# EAGLE schematic Attenuverting_LinExp_VCA_Bottom (EAGLE 8.3.2)

## Sheet 1 of 4: VCA Paths
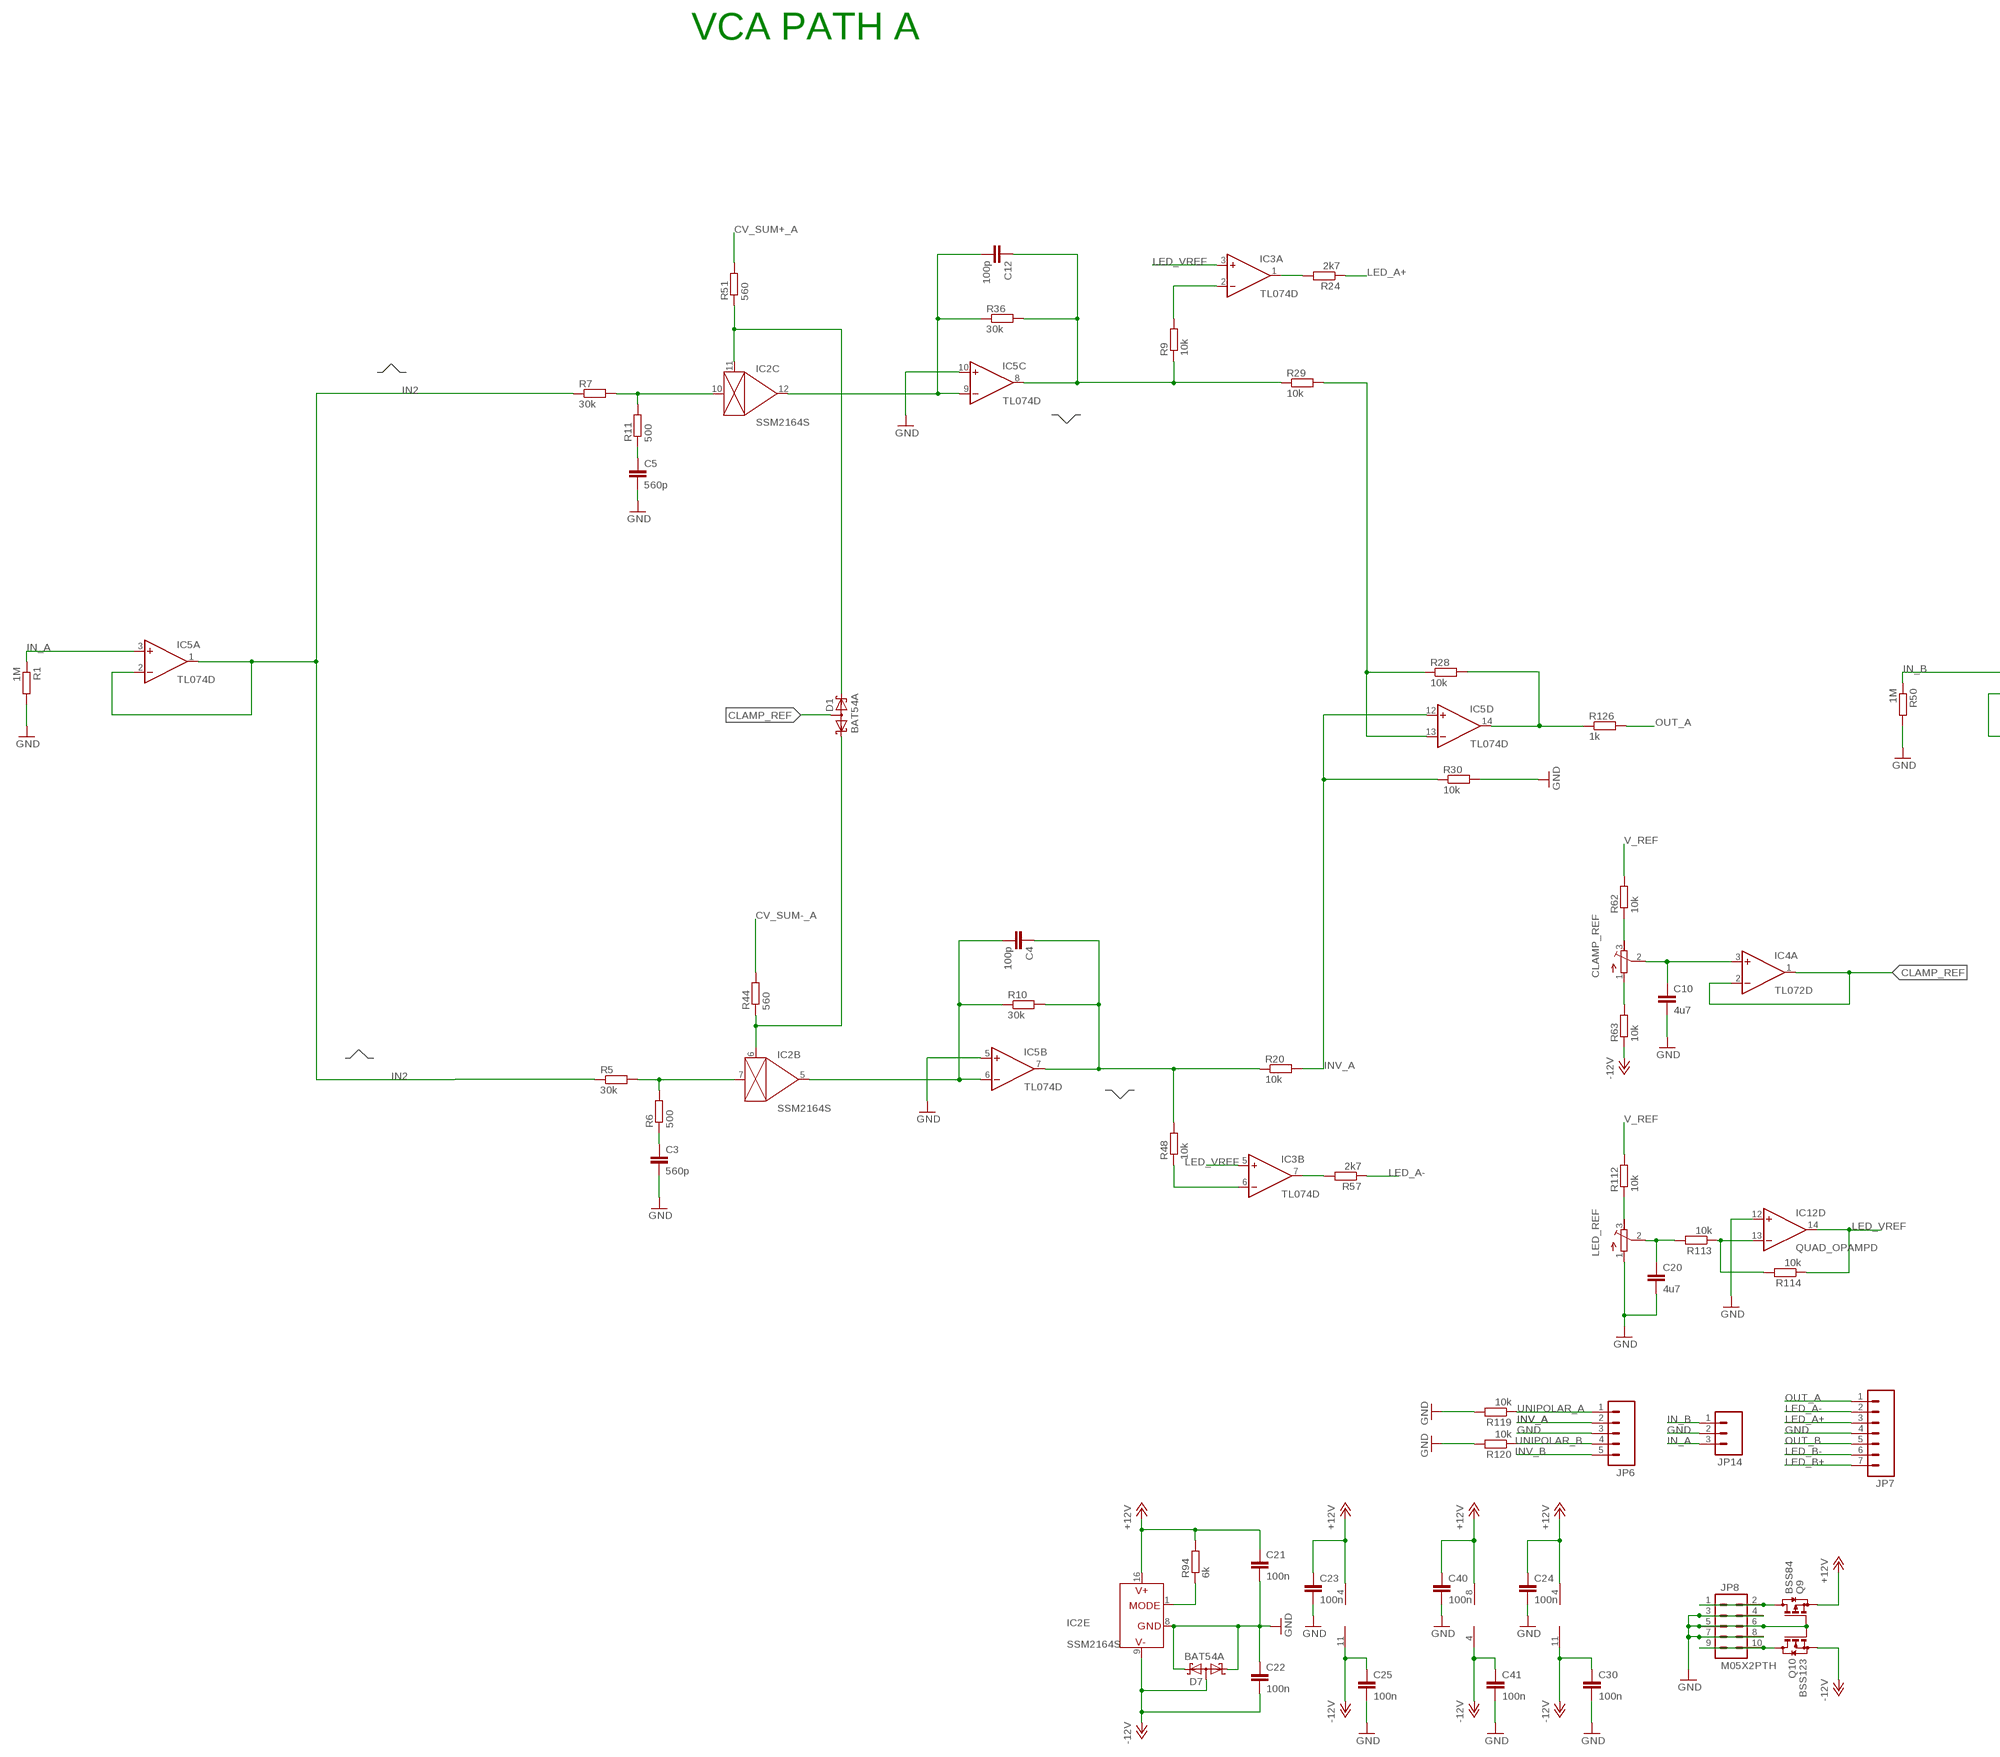
[diagram p0: schematic, sheet 1, part 1 of 2]
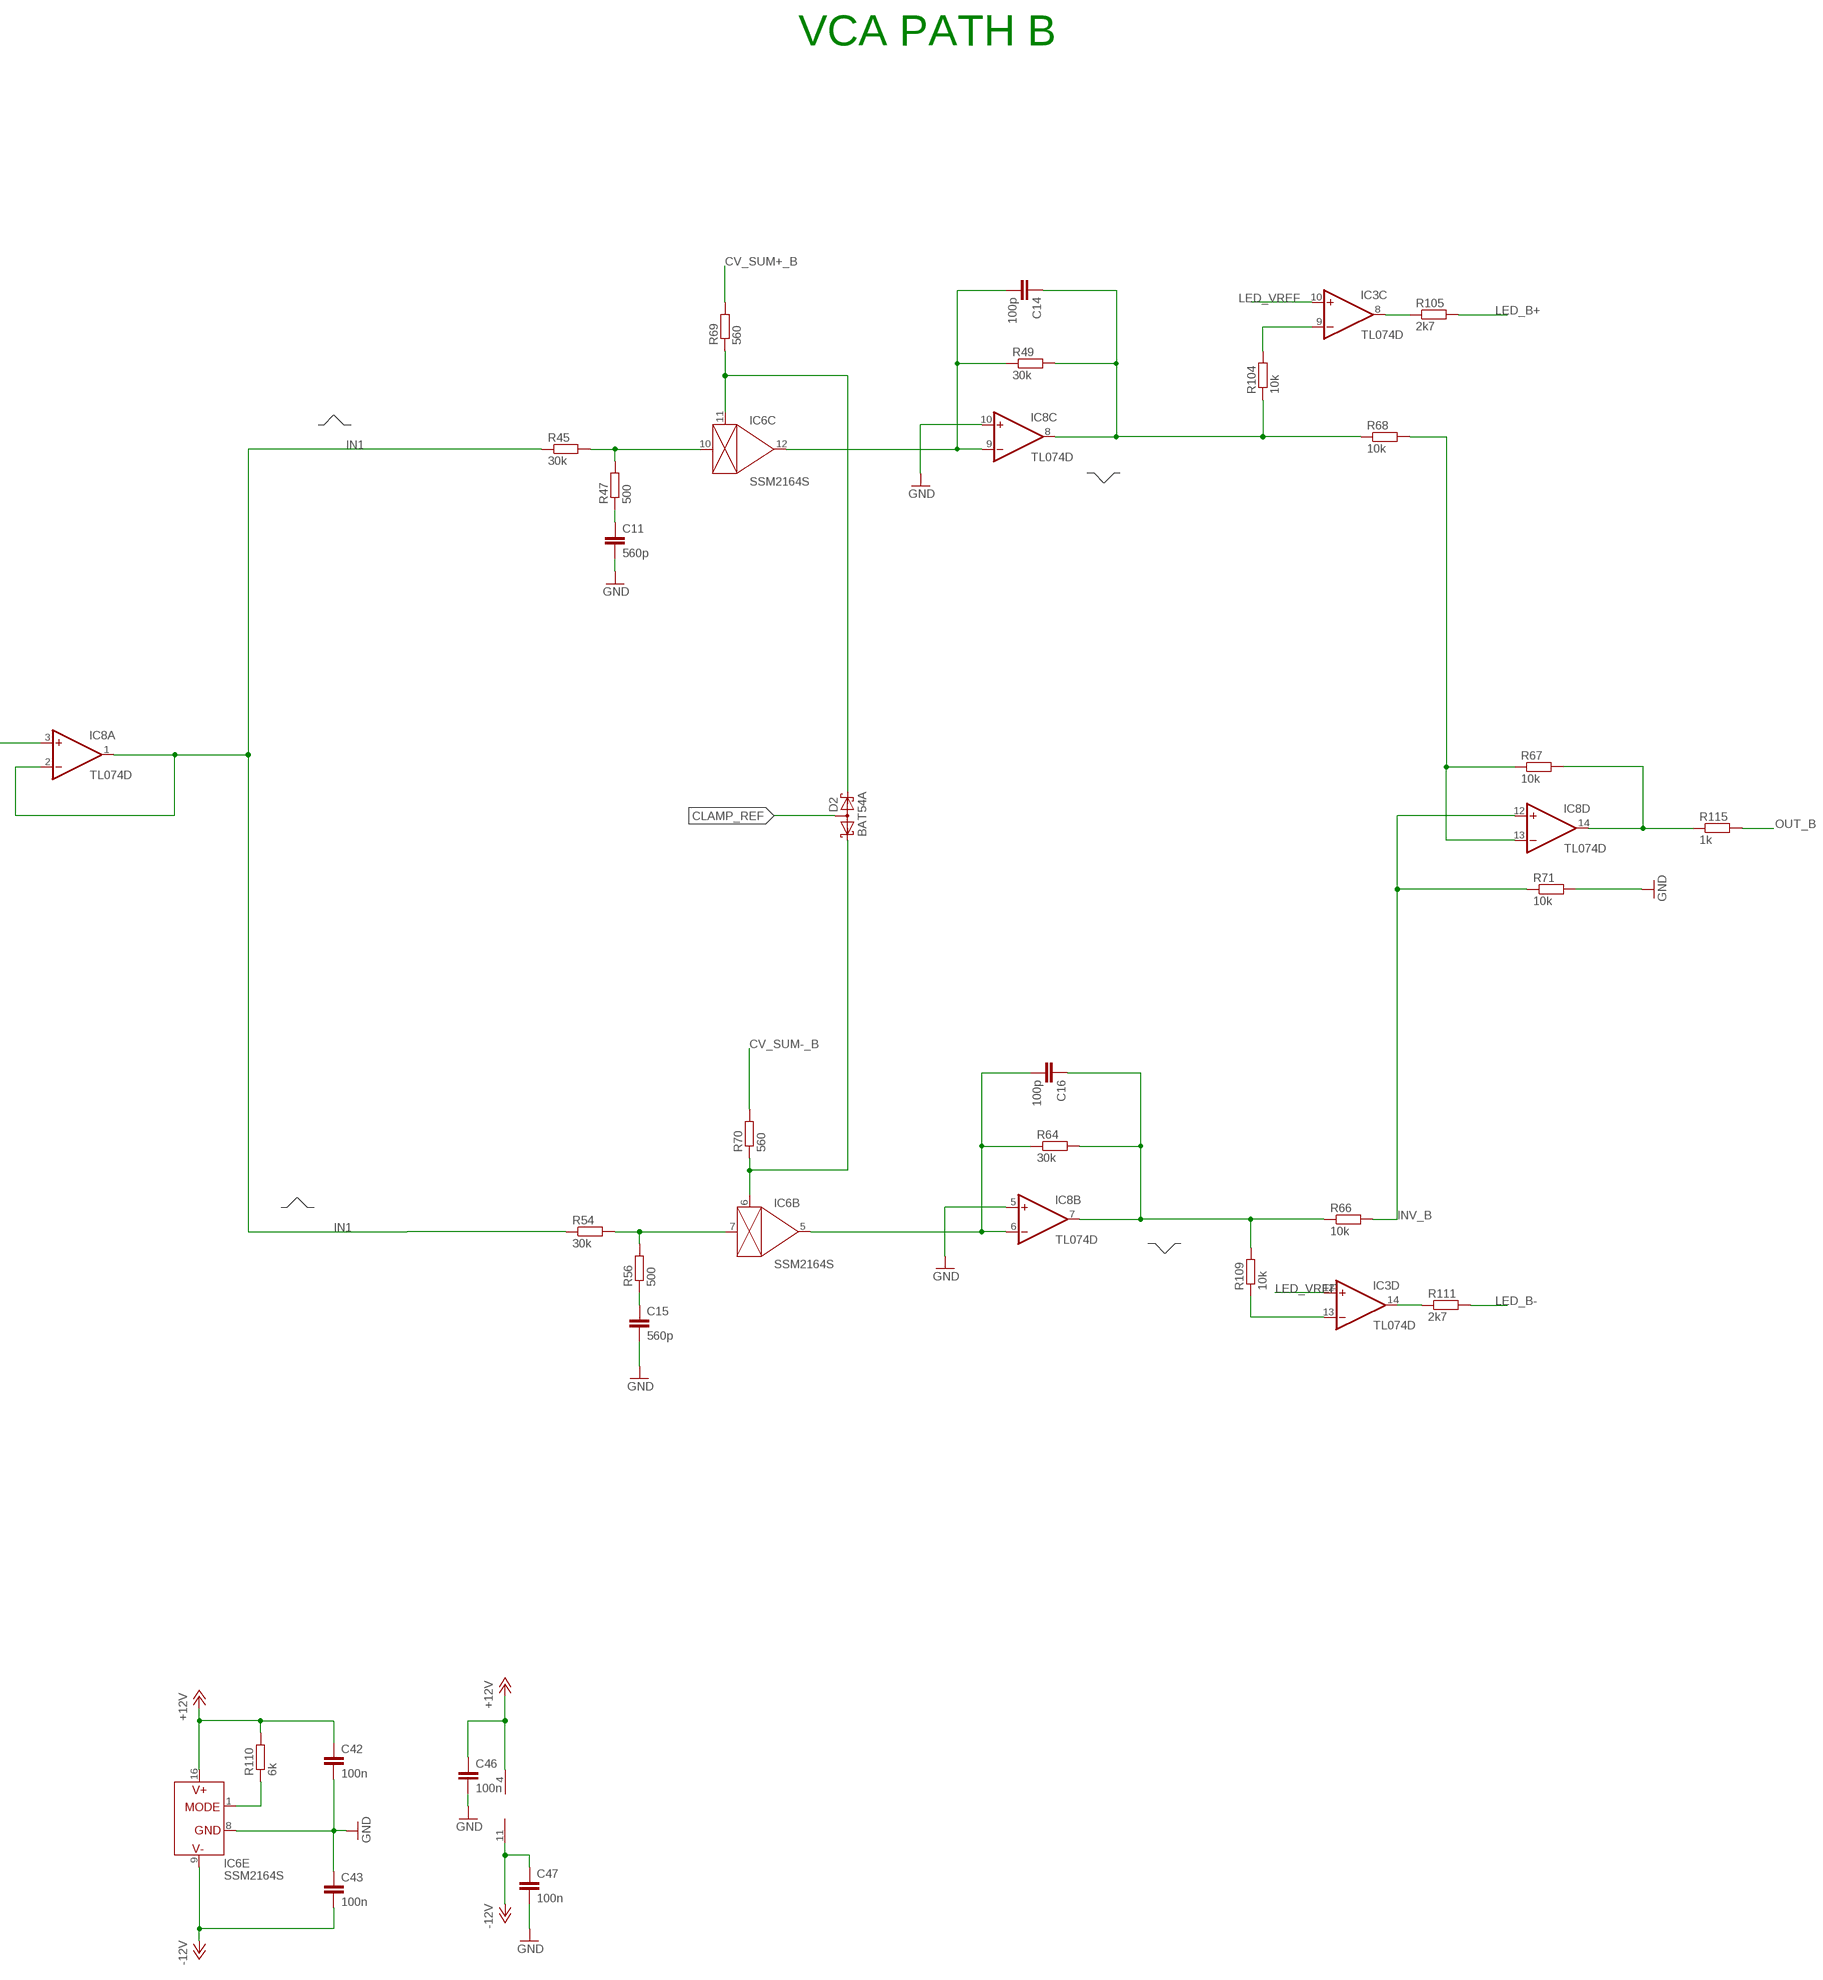
[diagram p1: schematic, sheet 1, part 2 of 2]

### Parts
C3  560p  C-EUC0603K  [C0603K]
C4  100p  C-EUC0603K  [C0603K]
C5  560p  C-EUC0603K  [C0603K]
C10  4u7  C-EUC0603K  [C0603K]
C11  560p  C-EUC0603K  [C0603K]
C12  100p  C-EUC0603K  [C0603K]
C14  100p  C-EUC0603K  [C0603K]
C15  560p  C-EUC0603K  [C0603K]
C16  100p  C-EUC0603K  [C0603K]
C20  4u7  C-EUC0603K  [C0603K]
C21  100n  C-EUC0603K  [C0603K]
C22  100n  C-EUC0603K  [C0603K]
C23  100n  C-EUC0603K  [C0603K]
C24  100n  C-EUC0603K  [C0603K]
C25  100n  C-EUC0603K  [C0603K]
C30  100n  C-EUC0603K  [C0603K]
C40  100n  C-EUC0603K  [C0603K]
C41  100n  C-EUC0603K  [C0603K]
C42  100n  C-EUC0603K  [C0603K]
C43  100n  C-EUC0603K  [C0603K]
C46  100n  C-EUC0603K  [C0603K]
C47  100n  C-EUC0603K  [C0603K]
CLAMP_REF  R-TRIMM64W  [RTRIM64W]
D1  BAT54A  [SOT23]
D2  BAT54A  [SOT23]
D7  BAT54A  [SOT23]
IC2  SSM2164S  [SOIC16N]
IC3  TL074D  [SO14]
IC4  TL072D  [SO08]
IC5  TL074D  [SO14]
IC6  SSM2164S  [SOIC16N]
IC8  TL074D  [SO14]
IC12  QUAD_OPAMPD  [SO14]
JP6  M05PTH  [1X05]
JP7  M07  [1X07]
JP8  M05X2PTH  [AVR_ICSP]
JP14  M03PTH  [1X03]
LED_REF  R-TRIMM64W  [RTRIM64W]
Q9  BSS84  [SOT23]
Q10  BSS123  [SOT23]
R1  1M  R-EU_0603  [0603]
R5  30k  R-EU_0603  [0603]
R6  500  R-EU_0603  [0603]
R7  30k  R-EU_0603  [0603]
R9  10k  R-EU_0603  [0603]
R10  30k  R-EU_0603  [0603]
R11  500  R-EU_0603  [0603]
R20  10k  R-EU_0603  [0603]
R24  2k7  R-EU_0603  [0603]
R28  10k  R-EU_0603  [0603]
R29  10k  R-EU_0603  [0603]
R30  10k  R-EU_0603  [0603]
R36  30k  R-EU_0603  [0603]
R44  560  R-EU_0603  [0603]
R45  30k  R-EU_0603  [0603]
R47  500  R-EU_0603  [0603]
R48  10k  R-EU_0603  [0603]
R49  30k  R-EU_0603  [0603]
R50  1M  R-EU_0603  [0603]
R51  560  R-EU_0603  [0603]
R54  30k  R-EU_0603  [0603]
R56  500  R-EU_0603  [0603]
R57  2k7  R-EU_0603  [0603]
R62  10k  R-EU_0603  [0603]
R63  10k  R-EU_0603  [0603]
R64  30k  R-EU_0603  [0603]
R66  10k  R-EU_0603  [0603]
R67  10k  R-EU_0603  [0603]
R68  10k  R-EU_0603  [0603]
R69  560  R-EU_0603  [0603]
R70  560  R-EU_0603  [0603]
R71  10k  R-EU_0603  [0603]
R94  6k  R-EU_0603  [0603]
R104  10k  R-EU_0603  [0603]
R105  2k7  R-EU_0603  [0603]
R109  10k  R-EU_0603  [0603]
R110  6k  R-EU_0603  [0603]
R111  2k7  R-EU_0603  [0603]
R112  10k  R-EU_0603  [0603]
R113  10k  R-EU_0603  [0603]
R114  10k  R-EU_0603  [0603]
R115  1k  R-EU_0603  [0603]
R119  10k  R-EU_0603  [0603]
R120  10k  R-EU_0603  [0603]
R126  1k  R-EU_0603  [0603]

### Nets
+12V: C21.1 C23.1 C24.1 C40.1 C42.1 C46.1 IC2.16(E:V+) IC3.4(P:V+) IC4.8(P:V+) IC5.4(P:V+) IC6.16(E:V+) IC8.4(P:V+) Q9.2(S) R94.2 R110.2 ; also sheet 2,3,4
-12V: C22.2 C25.1 C30.1 C41.1 C43.2 C47.1 D7.3(AA) IC2.9(E:V-) IC3.11(P:V-) IC4.4(P:V-) IC5.11(P:V-) IC6.9(E:V-) IC8.11(P:V-) Q10.2(S) R63.1 ; also sheet 2,3,4
CLAMP_REF: D1.3(AA) D2.3(AA) IC4.1(A:OUT) IC4.2(A:-IN)
CV_SUM+_A: R51.2 ; also sheet 4
CV_SUM+_B: R69.2 ; also sheet 4
CV_SUM-_A: R44.2 ; also sheet 4
CV_SUM-_B: R70.2 ; also sheet 4
GND: C3.2 C5.2 C10.2 C11.2 C15.2 C20.2 C21.2 C22.1 C23.2 C24.2 C25.2 C30.2 C40.2 C41.2 C42.2 C43.1 C46.2 C47.2 D7.1(K1) D7.2(K2) IC2.8(E:GND) IC5.5(B:+IN) IC5.10(C:+IN) IC6.8(E:GND) IC8.5(B:+IN) IC8.10(C:+IN) IC12.12(D:+IN) JP6.3 JP7.4 JP8.3 JP8.4 JP8.5 JP8.6 JP8.7 JP8.8 JP14.2 LED_REF.1(A) Q9.1(G) Q10.1(G) R1.2 R30.2 R50.2 R71.2 R119.2 R120.2 ; also sheet 2,3,4
IC2B_1: D2.1(K1) IC6.6(B:CTRL) R70.1
IC2B_6: D1.1(K1) IC2.6(B:CTRL) R44.1
IC2C_1: D2.2(K2) IC6.11(C:CTRL) R69.1
IC2C_11: D1.2(K2) IC2.11(C:CTRL) R51.1
IN1: IC8.1(A:OUT) IC8.2(A:-IN) R45.1 R54.1
IN2: IC5.1(A:OUT) IC5.2(A:-IN) R5.1 R7.1
IN_A: IC5.3(A:+IN) JP14.3 R1.1
IN_B: IC8.3(A:+IN) JP14.1 R50.1
INV_A: IC5.12(D:+IN) JP6.2 R20.2 R30.1
INV_B: IC8.12(D:+IN) JP6.5 R66.2 R71.1
LED_A+: JP7.3 R24.1
LED_A-: JP7.2 R57.1
LED_B+: JP7.7 R105.2
LED_B-: JP7.6 R111.2
LED_VREF: IC3.3(A:+IN) IC3.5(B:+IN) IC3.10(C:+IN) IC3.12(D:+IN) IC12.14(D:OUT) R114.1
N$4: JP8.9 JP8.10 Q10.3(D)
N$5: IC3.1(A:OUT) R24.2
N$6: C3.1 R6.1
N$7: JP8.1 JP8.2 Q9.3(D)
N$9: IC3.2(A:-IN) R9.2
N$13: IC12.13(D:-IN) R113.1 R114.2
N$14: IC3.6(B:-IN) R48.1
N$15: IC5.13(D:-IN) R28.1 R29.2
N$16: IC2.7(B:IN) R5.2 R6.2
N$18: IC3.7(B:OUT) R57.2
N$19: C5.1 R11.1
N$20: C4.2 IC2.5(B:OUT) IC5.6(B:-IN) R10.1
N$21: C4.1 IC5.7(B:OUT) R10.2 R20.1 R48.2
N$23: IC2.10(C:IN) R7.2 R11.2
N$24: IC5.14(D:OUT) R28.2 R126.1
N$25: C11.1 R47.1
N$26: IC3.9(C:-IN) R104.2
N$27: IC3.13(D:-IN) R109.1
N$33: IC6.10(C:IN) R45.2 R47.2
N$37: CLAMP_REF.3(E) R62.1
N$42: IC3.8(C:OUT) R105.1
N$43: IC3.14(D:OUT) R111.1
N$44: C14.2 IC6.12(C:OUT) IC8.9(C:-IN) R49.1
N$46: C14.1 IC8.8(C:OUT) R49.2 R68.1 R104.1
N$47: C15.1 R56.1
N$48: IC6.7(B:IN) R54.2 R56.2
N$49: C12.2 IC2.12(C:OUT) IC5.9(C:-IN) R36.1
N$50: LED_REF.3(E) R112.1
N$51: C12.1 IC5.8(C:OUT) R9.1 R29.1 R36.2
N$52: C16.2 IC6.5(B:OUT) IC8.6(B:-IN) R64.1
N$56: CLAMP_REF.1(A) R63.2
N$57: C10.1 CLAMP_REF.2(S) IC4.3(A:+IN)
N$59: C16.1 IC8.7(B:OUT) R64.2 R66.1 R109.2
N$60: IC8.13(D:-IN) R67.1 R68.2
N$61: IC8.14(D:OUT) R67.2 R115.1
N$63: C20.1 LED_REF.2(S) R113.2
N$83: IC2.1(E:MODE) R94.1
N$97: IC6.1(E:MODE) R110.1
OUT_A: JP7.1 R126.2
OUT_B: JP7.5 R115.2
UNIPOLAR_A: JP6.1 R119.1
UNIPOLAR_B: JP6.4 R120.1
V_REF: R62.2 R112.2 ; also sheet 3,4

### Notes on the sheet
- VCA PATH A
- VCA PATH B

## Sheet 2 of 4: Control Inputs
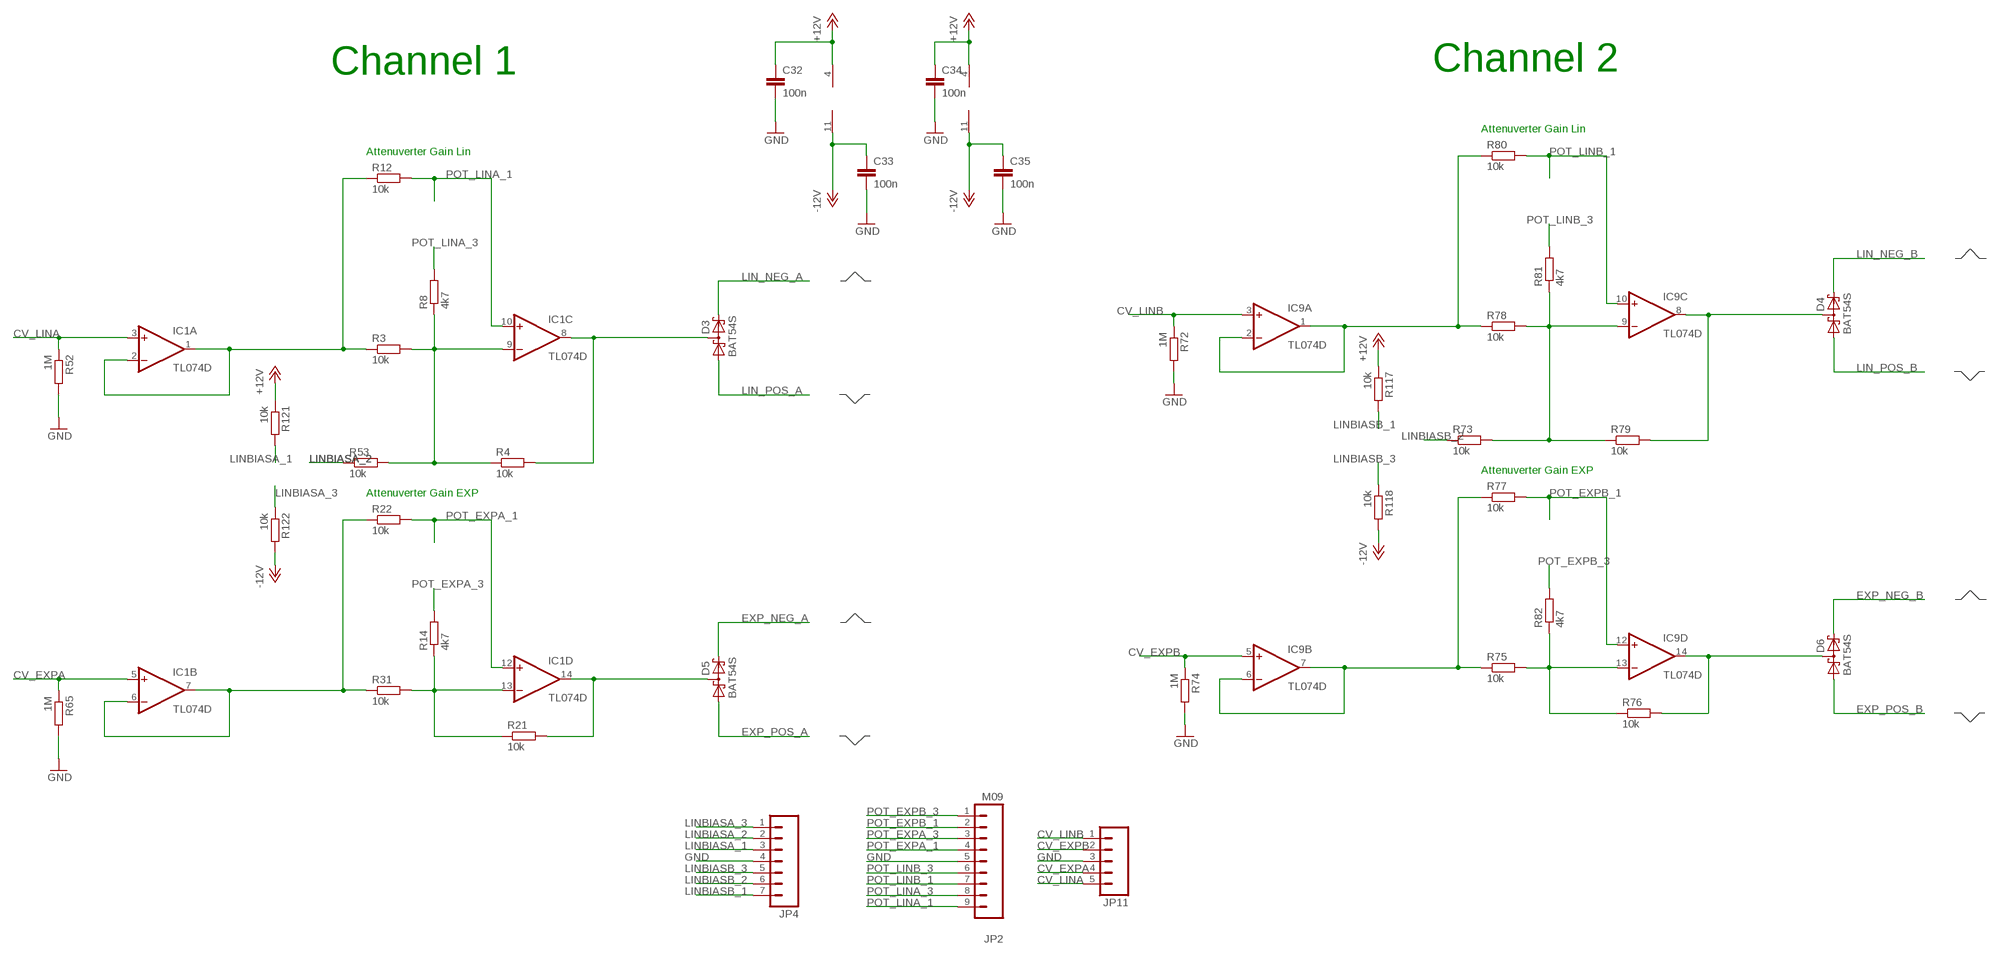
[diagram p2: schematic, sheet 2]

### Parts
C32  100n  C-EUC0603K  [C0603K]
C33  100n  C-EUC0603K  [C0603K]
C34  100n  C-EUC0603K  [C0603K]
C35  100n  C-EUC0603K  [C0603K]
D3  BAT54S  [SOT23]
D4  BAT54S  [SOT23]
D5  BAT54S  [SOT23]
D6  BAT54S  [SOT23]
IC1  TL074D  [SO14]
IC9  TL074D  [SO14]
JP2  M09  [1X09]
JP4  M07  [1X07]
JP11  M05PTH  [1X05]
R3  10k  R-EU_0603  [0603]
R4  10k  R-EU_0603  [0603]
R8  4k7  R-EU_0603  [0603]
R12  10k  R-EU_0603  [0603]
R14  4k7  R-EU_0603  [0603]
R21  10k  R-EU_0603  [0603]
R22  10k  R-EU_0603  [0603]
R31  10k  R-EU_0603  [0603]
R52  1M  R-EU_0603  [0603]
R53  10k  R-EU_0603  [0603]
R65  1M  R-EU_0603  [0603]
R72  1M  R-EU_0603  [0603]
R73  10k  R-EU_0603  [0603]
R74  1M  R-EU_0603  [0603]
R75  10k  R-EU_0603  [0603]
R76  10k  R-EU_0603  [0603]
R77  10k  R-EU_0603  [0603]
R78  10k  R-EU_0603  [0603]
R79  10k  R-EU_0603  [0603]
R80  10k  R-EU_0603  [0603]
R81  4k7  R-EU_0603  [0603]
R82  4k7  R-EU_0603  [0603]
R117  10k  R-EU_0603  [0603]
R118  10k  R-EU_0603  [0603]
R121  10k  R-EU_0603  [0603]
R122  10k  R-EU_0603  [0603]

### Nets
+12V: C32.1 C34.1 IC1.4(P:V+) IC9.4(P:V+) R117.1 R121.1 ; also sheet 1,3,4
-12V: C33.1 C35.1 IC1.11(P:V-) IC9.11(P:V-) R118.2 R122.2 ; also sheet 1,3,4
CV_1+: IC1.6(B:-IN) IC1.7(B:OUT) R22.1 R31.1
CV_1+1: IC9.6(B:-IN) IC9.7(B:OUT) R75.1 R77.1
CV_1-: IC1.1(A:OUT) IC1.2(A:-IN) R3.1 R12.1
CV_1-1: IC9.1(A:OUT) IC9.2(A:-IN) R78.1 R80.1
CV_EXPA: IC1.5(B:+IN) JP11.4 R65.1
CV_EXPB: IC9.5(B:+IN) JP11.2 R74.1
CV_LINA: IC1.3(A:+IN) JP11.5 R52.1
CV_LINB: IC9.3(A:+IN) JP11.1 R72.1
EXP_NEG_A: D5.2(C2) ; also sheet 4
EXP_NEG_B: D6.2(C2) ; also sheet 4
EXP_POS_A: D5.1(A1) ; also sheet 4
EXP_POS_B: D6.1(A1) ; also sheet 4
GND: C32.2 C33.2 C34.2 C35.2 JP2.5 JP4.4 JP11.3 R52.2 R65.2 R72.2 R74.2 ; also sheet 1,3,4
LIN_NEG_A: D3.2(C2) ; also sheet 3
LIN_NEG_B: D4.2(C2) ; also sheet 3
LIN_POS_A: D3.1(A1) ; also sheet 3
LIN_POS_B: D4.1(A1) ; also sheet 3
LINBIASA_1: JP4.3 R121.2
LINBIASA_2: JP4.2 R53.1
LINBIASA_3: JP4.1 R122.1
LINBIASB_1: JP4.7 R117.2
LINBIASB_2: JP4.6 R73.1
LINBIASB_3: JP4.5 R118.1
N$2: D3.3(C1A2) IC1.8(C:OUT) R4.2
N$12: IC1.13(D:-IN) R14.1 R21.1 R31.2
N$17: IC1.9(C:-IN) R3.2 R4.1 R8.1 R53.2
N$65: D6.3(C1A2) IC9.14(D:OUT) R76.2
N$66: IC9.13(D:-IN) R75.2 R76.1 R82.1
N$69: D4.3(C1A2) IC9.8(C:OUT) R79.2
N$74: IC9.9(C:-IN) R73.2 R78.2 R79.1 R81.1
N$94: D5.3(C1A2) IC1.14(D:OUT) R21.2
POT_EXPA_1: IC1.12(D:+IN) JP2.4 R22.2
POT_EXPA_3: JP2.3 R14.2
POT_EXPB_1: IC9.12(D:+IN) JP2.2 R77.2
POT_EXPB_3: JP2.1 R82.2
POT_LINA_1: IC1.10(C:+IN) JP2.9 R12.2
POT_LINA_3: JP2.8 R8.2
POT_LINB_1: IC9.10(C:+IN) JP2.7 R80.2
POT_LINB_3: JP2.6 R81.2

### Notes on the sheet
- Channel 2
- Channel 1
- Attenuverter Gain Lin
- Attenuverter Gain Lin
- Attenuverter Gain EXP
- Attenuverter Gain EXP

## Sheet 3 of 4: Linearsing CV
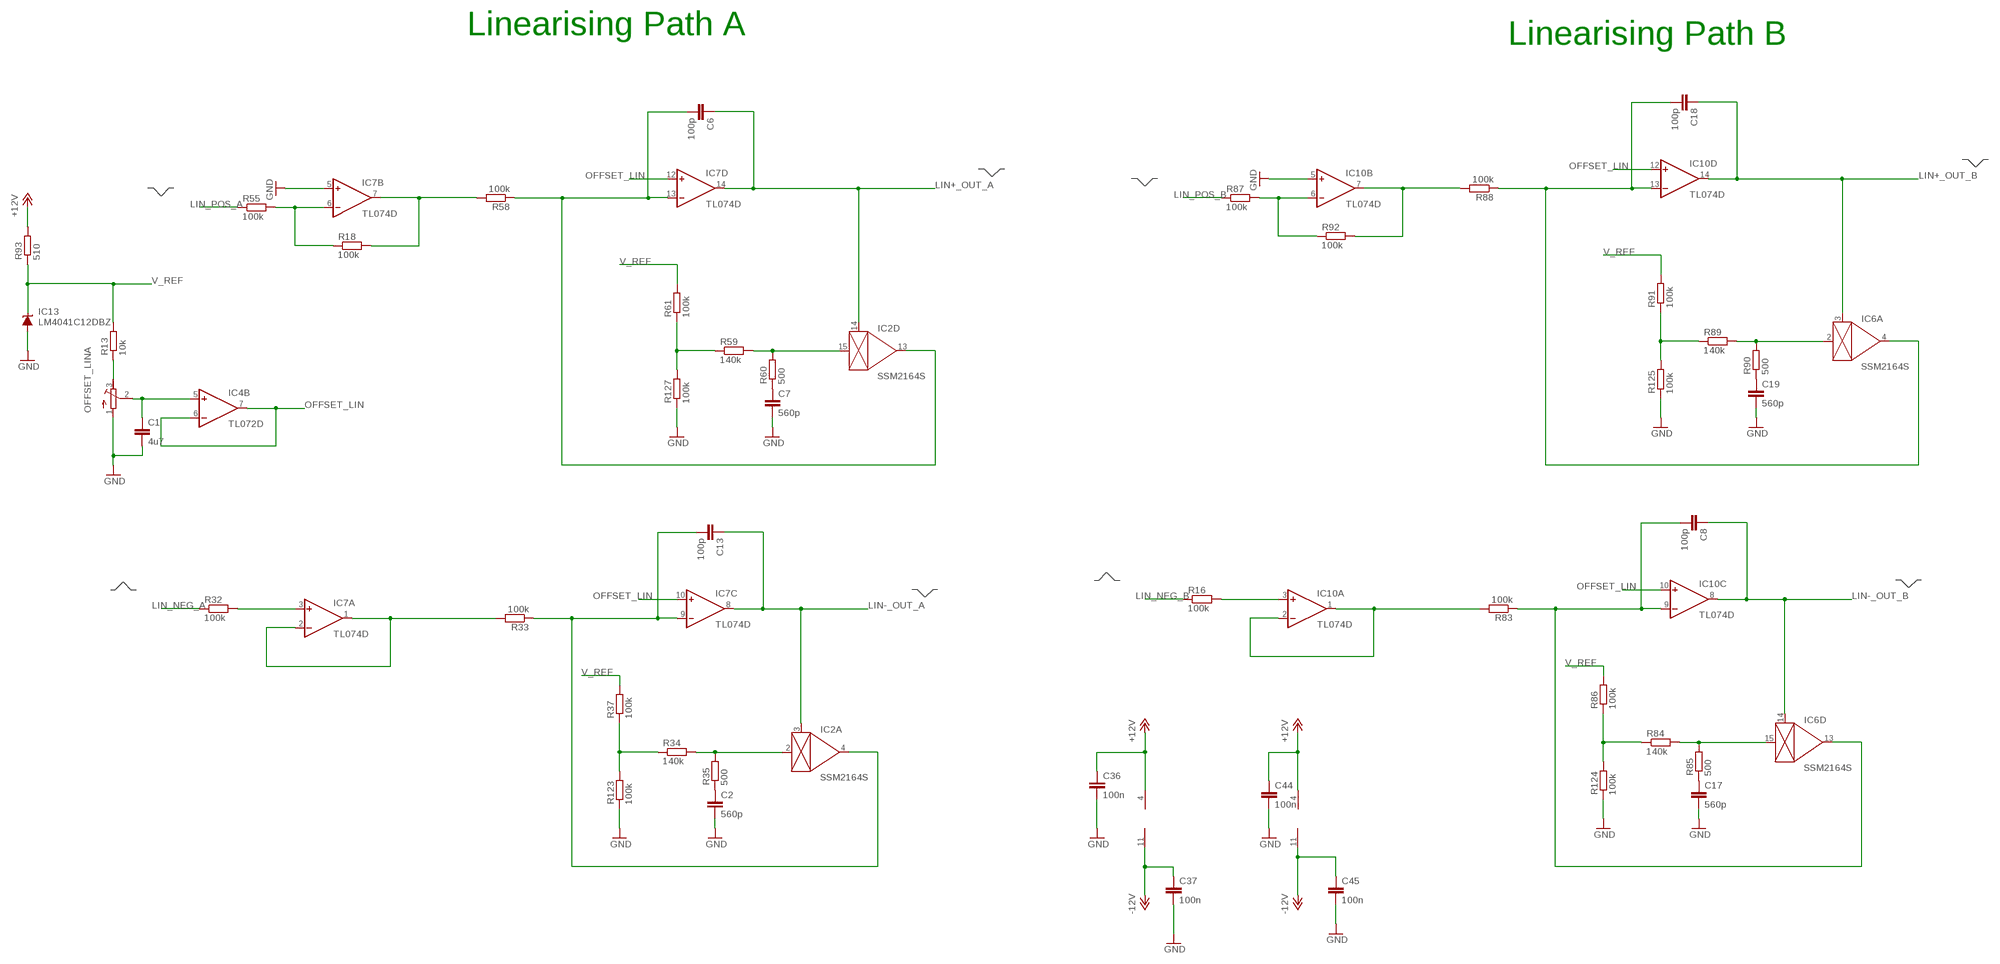
[diagram p3: schematic, sheet 3]

### Parts
C1  4u7  C-EUC0603K  [C0603K]
C2  560p  C-EUC0603K  [C0603K]
C6  100p  C-EUC0603K  [C0603K]
C7  560p  C-EUC0603K  [C0603K]
C8  100p  C-EUC0603K  [C0603K]
C13  100p  C-EUC0603K  [C0603K]
C17  560p  C-EUC0603K  [C0603K]
C18  100p  C-EUC0603K  [C0603K]
C19  560p  C-EUC0603K  [C0603K]
C36  100n  C-EUC0603K  [C0603K]
C37  100n  C-EUC0603K  [C0603K]
C44  100n  C-EUC0603K  [C0603K]
C45  100n  C-EUC0603K  [C0603K]
IC7  TL074D  [SO14]
IC10  TL074D  [SO14]
IC13  LM4041C12DBZ  [DBZ_R-PDSO-G3]
OFFSET_LINA  R-TRIMM64W  [RTRIM64W]
R13  10k  R-EU_0603  [0603]
R16  100k  R-EU_0603  [0603]
R18  100k  R-EU_0603  [0603]
R32  100k  R-EU_0603  [0603]
R33  100k  R-EU_0603  [0603]
R34  140k  R-EU_0603  [0603]
R35  500  R-EU_0603  [0603]
R37  100k  R-EU_0603  [0603]
R55  100k  R-EU_0603  [0603]
R58  100k  R-EU_0603  [0603]
R59  140k  R-EU_0603  [0603]
R60  500  R-EU_0603  [0603]
R61  100k  R-EU_0603  [0603]
R83  100k  R-EU_0603  [0603]
R84  140k  R-EU_0603  [0603]
R85  500  R-EU_0603  [0603]
R86  100k  R-EU_0603  [0603]
R87  100k  R-EU_0603  [0603]
R88  100k  R-EU_0603  [0603]
R89  140k  R-EU_0603  [0603]
R90  500  R-EU_0603  [0603]
R91  100k  R-EU_0603  [0603]
R92  100k  R-EU_0603  [0603]
R93  510  R-EU_0603  [0603]
R123  100k  R-EU_0603  [0603]
R124  100k  R-EU_0603  [0603]
R125  100k  R-EU_0603  [0603]
R127  100k  R-EU_0603  [0603]

### Nets
+12V: C36.1 C44.1 IC7.4(P:V+) IC10.4(P:V+) R93.2 ; also sheet 1,2,4
-10V: R34.1 R37.1 R123.2
-10V1: R59.1 R61.1 R127.2
-10V2: R89.1 R91.1 R125.2
-10V3: R84.1 R86.1 R124.2
-12V: C37.1 C45.1 IC7.11(P:V-) IC10.11(P:V-) ; also sheet 1,2,4
GND: C1.2 C2.2 C7.2 C17.2 C19.2 C36.2 C37.2 C44.2 C45.2 IC7.5(B:+IN) IC10.5(B:+IN) IC13.2(A) OFFSET_LINA.1(A) R123.1 R124.1 R125.1 R127.1 ; also sheet 1,2,4
IC2_4: C13.2 IC2.4(A:OUT) IC7.9(C:-IN) R33.1
IC2_13: C6.2 IC2.13(D:OUT) IC7.13(D:-IN) R58.1
IC6_4: C18.2 IC6.4(A:OUT) IC10.13(D:-IN) R88.1
IC6_13: C8.2 IC6.13(D:OUT) IC10.9(C:-IN) R83.1
LIN+_OUT_A: C6.1 IC2.14(D:CTRL) IC7.14(D:OUT) ; also sheet 4
LIN+_OUT_B: C18.1 IC6.3(A:CTRL) IC10.14(D:OUT) ; also sheet 4
LIN-_OUT_A: C13.1 IC2.3(A:CTRL) IC7.8(C:OUT) ; also sheet 4
LIN-_OUT_B: C8.1 IC6.14(D:CTRL) IC10.8(C:OUT) ; also sheet 4
LIN_NEG_A: R32.1 ; also sheet 2
LIN_NEG_B: R16.1 ; also sheet 2
LIN_POS_A: R55.1 ; also sheet 2
LIN_POS_B: R87.1 ; also sheet 2
N$28: IC7.1(A:OUT) IC7.2(A:-IN) R33.2
N$29: C2.1 R35.1
N$30: IC2.2(A:IN) R34.2 R35.2
N$31: IC7.6(B:-IN) R18.1 R55.2
N$32: IC10.7(B:OUT) R88.2 R92.2
N$34: C19.1 R90.1
N$35: OFFSET_LINA.3(E) R13.1
N$38: C1.1 IC4.5(B:+IN) OFFSET_LINA.2(S)
N$39: IC7.3(A:+IN) R32.2
N$53: IC7.7(B:OUT) R18.2 R58.2
N$54: C7.1 R60.1
N$55: IC2.15(D:IN) R59.2 R60.2
N$58: IC6.2(A:IN) R89.2 R90.2
N$64: IC10.1(A:OUT) IC10.2(A:-IN) R83.2
N$77: IC10.3(A:+IN) R16.2
N$78: C17.1 R85.1
N$79: IC6.15(D:IN) R84.2 R85.2
N$80: IC10.6(B:-IN) R87.2 R92.1
OFFSET_LIN: IC4.6(B:-IN) IC4.7(B:OUT) IC7.10(C:+IN) IC7.12(D:+IN) IC10.10(C:+IN) IC10.12(D:+IN)
V_REF: IC13.1(C) R13.2 R37.2 R61.2 R86.2 R91.2 R93.1 ; also sheet 1,4

### Notes on the sheet
- Linearising Path A | Linearising Path B

## Sheet 4 of 4: CV Scale and Sum
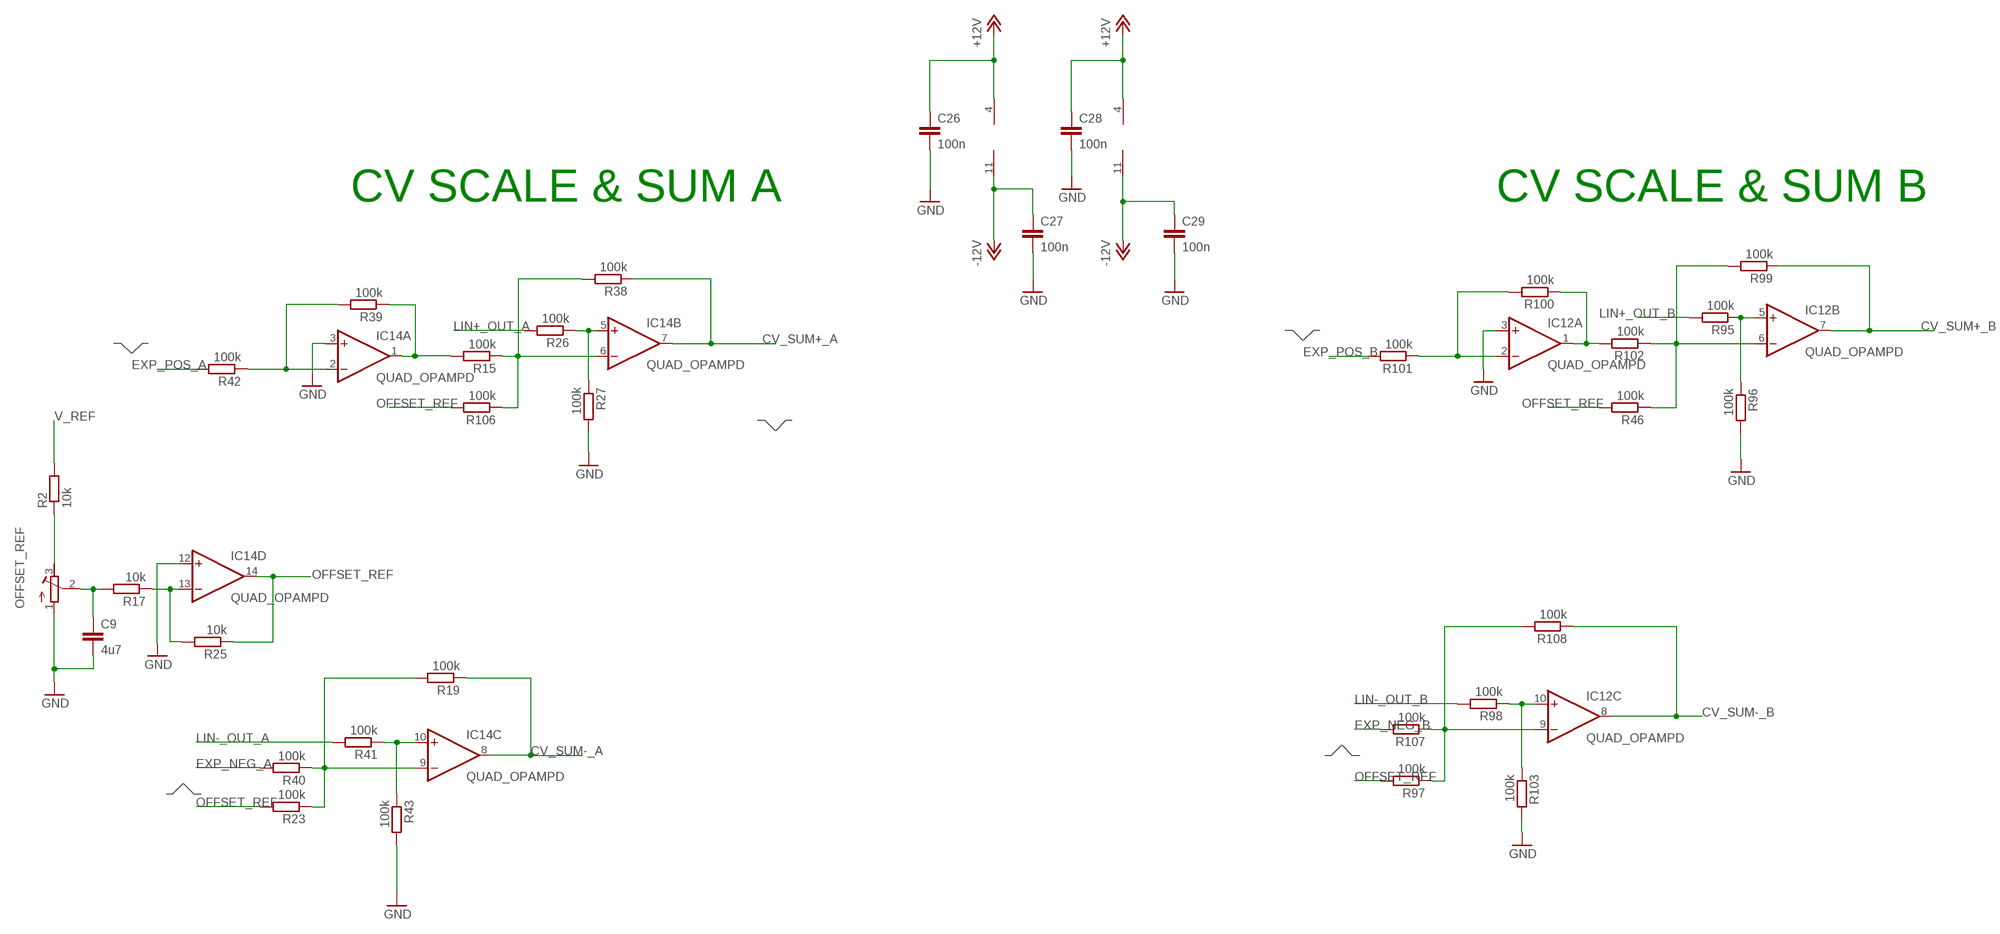
[diagram p4: schematic, sheet 4]

### Parts
C9  4u7  C-EUC0603K  [C0603K]
C26  100n  C-EUC0603K  [C0603K]
C27  100n  C-EUC0603K  [C0603K]
C28  100n  C-EUC0603K  [C0603K]
C29  100n  C-EUC0603K  [C0603K]
IC14  QUAD_OPAMPD  [SO14]
OFFSET_REF  R-TRIMM64W  [RTRIM64W]
R2  10k  R-EU_0603  [0603]
R15  100k  R-EU_0603  [0603]
R17  10k  R-EU_0603  [0603]
R19  100k  R-EU_0603  [0603]
R23  100k  R-EU_0603  [0603]
R25  10k  R-EU_0603  [0603]
R26  100k  R-EU_0603  [0603]
R27  100k  R-EU_0603  [0603]
R38  100k  R-EU_0603  [0603]
R39  100k  R-EU_0603  [0603]
R40  100k  R-EU_0603  [0603]
R41  100k  R-EU_0603  [0603]
R42  100k  R-EU_0603  [0603]
R43  100k  R-EU_0603  [0603]
R46  100k  R-EU_0603  [0603]
R95  100k  R-EU_0603  [0603]
R96  100k  R-EU_0603  [0603]
R97  100k  R-EU_0603  [0603]
R98  100k  R-EU_0603  [0603]
R99  100k  R-EU_0603  [0603]
R100  100k  R-EU_0603  [0603]
R101  100k  R-EU_0603  [0603]
R102  100k  R-EU_0603  [0603]
R103  100k  R-EU_0603  [0603]
R106  100k  R-EU_0603  [0603]
R107  100k  R-EU_0603  [0603]
R108  100k  R-EU_0603  [0603]

### Nets
+12V: C26.1 C28.1 IC12.4(P:V+) IC14.4(P:V+) ; also sheet 1,2,3
-12V: C27.1 C29.1 IC12.11(P:V-) IC14.11(P:V-) ; also sheet 1,2,3
CV_SUM+_A: IC14.7(B:OUT) R38.1 ; also sheet 1
CV_SUM+_B: IC12.7(B:OUT) R99.1 ; also sheet 1
CV_SUM-_A: IC14.8(C:OUT) R19.1 ; also sheet 1
CV_SUM-_B: IC12.8(C:OUT) R108.1 ; also sheet 1
EXP_NEG_A: R40.2 ; also sheet 2
EXP_NEG_B: R107.2 ; also sheet 2
EXP_POS_A: R42.2 ; also sheet 2
EXP_POS_B: R101.2 ; also sheet 2
GND: C9.2 C26.2 C27.2 C28.2 C29.2 IC12.3(A:+IN) IC14.3(A:+IN) IC14.12(D:+IN) OFFSET_REF.1(A) R27.2 R43.2 R96.2 R103.2 ; also sheet 1,2,3
IC2_2: IC12.6(B:-IN) R46.1 R99.2 R102.1
IC2_8: IC14.6(B:-IN) R15.1 R38.2 R106.1
LIN+_OUT_A: R26.2 ; also sheet 3
LIN+_OUT_B: R95.2 ; also sheet 3
LIN-_OUT_A: R41.2 ; also sheet 3
LIN-_OUT_B: R98.2 ; also sheet 3
N$1: IC14.10(C:+IN) R41.1 R43.1
N$3: IC12.10(C:+IN) R98.1 R103.1
N$8: IC14.13(D:-IN) R17.1 R25.2
N$10: IC14.5(B:+IN) R26.1 R27.1
N$11: IC14.1(A:OUT) R15.2 R39.1
N$22: IC14.2(A:-IN) R39.2 R42.1
N$36: OFFSET_REF.3(E) R2.1
N$40: C9.1 OFFSET_REF.2(S) R17.2
N$41: IC14.9(C:-IN) R19.2 R23.1 R40.1
N$45: IC12.5(B:+IN) R95.1 R96.1
N$86: IC12.2(A:-IN) R100.2 R101.1
N$87: IC12.1(A:OUT) R100.1 R102.2
N$91: IC12.9(C:-IN) R97.1 R107.1 R108.2
OFFSET_REF: IC14.14(D:OUT) R23.2 R25.1 R46.2 R97.2 R106.2
V_REF: R2.2 ; also sheet 1,3

### Notes on the sheet
- CV SCALE & SUM A | CV SCALE & SUM B

## Library data of the parts
C1-C20 = resistor:C-EU: CAPACITOR, European symbol; OC_FARNELL: unknown
C21-C30 C32-C35 C40-C43 C46 C47 = rcl:C-EU: CAPACITOR, European symbol
C36 C37 C44 C45 = rcl@1:C-EU: CAPACITOR, European symbol
CLAMP_REF LED_REF OFFSET_LINA OFFSET_REF = resistor:R-TRIMM: Trimm resistor; OC_FARNELL: unknown
D1 D2 D7 = diode:BAT54A: Schottky Diodes Source: Fairchild .. BAT54.pdf
D3-D6 = diode:BAT54S: Schottky Diodes Pin connection corrected 2011-05-04 Source: Fairchild .. BAT54.pdf; OC_FARNELL: unknown
IC1 IC5 IC7-IC10 = linear:TL074: OP AMP; OC_FARNELL: unknown
IC2 IC6 = ssm2164:SSM2164; OC_FARNELL: unknown
IC3 = linear@1:TL074: OP AMP
IC4 = linear:TL072: OP AMP
IC12 IC14 = adafruit:QUAD_OPAMP: OP AMP Standard quad package
IC13 = texas:LM4041: PRECISION MICROPOWER SHUNT VOLTAGE REFERENCE Source: http://focus.ti.com/lit/ds/slcs146e/slcs146e.pdf; MF: TEXAS INSTRUMENT CONNECTORS; MPN: LM4041C12QDBZT; OC_FARNELL: 1771733; OC_NEWARK: 43K3376
JP2 = SparkFun:M09: Header 9 Standard 9-pin 0.1" header. Use with straight break away headers (SKU : PRT-00116), right angle break away headers (PRT-00553), swiss pins (PRT-00743), machine pins (PRT-00117), and female headers (PRT-00115).
JP4 JP7 = SparkFun:M07: Header 7 Standard 7-pin 0.1" header. Use with straight break away headers (SKU : PRT-00116), right angle break away headers (PRT-00553), swiss pins (PRT-00743), machine pins (PRT-00117), and female headers (PRT-00115). NOTES ON THE VARIANTS LOCK and LOCK_LONGPADS... This footprint was designed to help hold the alignment of a through-hole component (i.e. 7-pin header) while soldering it into place. You may notice that each hole has been shifted either up or down by 0.005 of an inch from it's more standard position (which is usually a perfectly straight line). This slight alteration caused the pins (the squares in the middle) to touch the edges of the holes. Because they are alternating, it causes a "brace" to hold the header in place. 0.005 has proven to be the perfect amount of "off-center" position when using our standard breakaway headers. Although looks a little odd when you look at the bare footprint, once you have a header in there, the alteration is very hard to notice. Also, if you push a header all the way into place, it is covered up entirely on the bottom side. This idea of altering the position of holes to aid alignment will be further integrated into the Sparkfun Library for other footprints. It can help hold any component with 3 or more connection pins.
JP6 JP11 = SparkFun:M05: Header 5 Standard 5-pin 0.1" header. Use with straight break away headers (SKU : PRT-00116), right angle break away headers (PRT-00553), swiss pins (PRT-00743), machine pins (PRT-00117), and female headers (PRT-00115). Molex polarized connector foot print use with SKU : PRT-08230 with associated crimp pins and housings.
JP8 = SparkFun:M05X2: Header 5x2 Standard 10-pin dual row 0.1" header. Commonly used with AVR-ISP. Use with Spark Fun Electronics SKU: PRT-00778
JP14 = SparkFun:M03: Header 3 Standard 3-pin 0.1" header. Use with straight break away headers (SKU : PRT-00116), right angle break away headers (PRT-00553), swiss pins (PRT-00743), machine pins (PRT-00117), and female headers (PRT-00115). Molex polarized connector foot print use with SKU : PRT-08232 with associated crimp pins and housings.
Q9 = transistor-small-signal:BSS84: P-CHANNEL MOS FET; OC_FARNELL: 1779264
Q10 = transistor-small-signal:BSS123: N-CHANNEL MOS FET; OC_FARNELL: 1843725
R1-R14 R16-R18 R20-R22 R24 R25 R28-R37 R44 R45 R47-R94 R104 R105 R109-R114 R117-R125 R127 = Rebel:R-EU_: RESISTOR, European symbol; OC_FARNELL: unknown
R15 R19 R23 R26 R27 R38-R43 R46 R95-R103 R106-R108 = Rebel:R-EU_: RESISTOR, European symbol
R115 R126 = Rebel:R-EU_: RESISTOR, European symbol; MF: MULTICOMP; MPN: MC0063W06031160K; OC_FARNELL: 9330682